# EAGLE design MPU9250 (EAGLE 9.6.2)
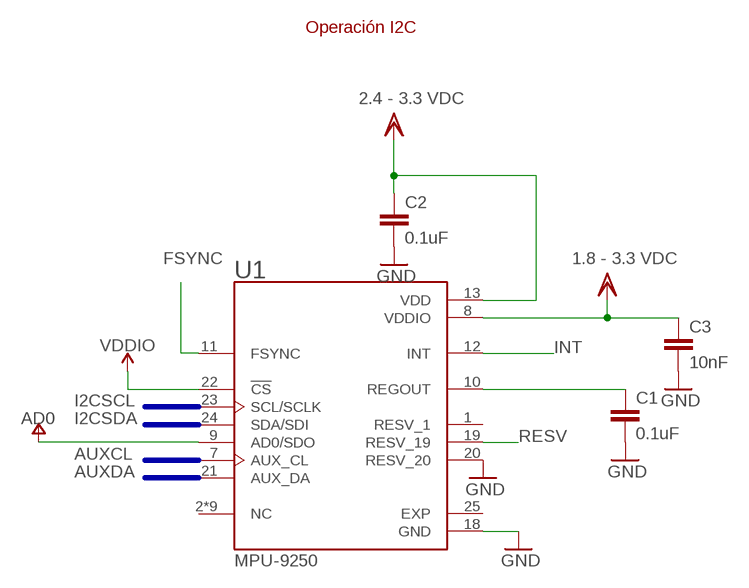
[diagram p0: schematic, sheet 1]

## Parts
C1  0.1uF  CAP-1206  [1206]
C2  0.1uF  CAP-1206  [1206]
C3  10nF  CAP-1206  [1206]
U1  MPU-9250  [QFN40P300X300X105-25N]

## Nets
FSYNC: U1.11(FSYNC)
GND: C1.2 C2.2 C3.2 U1.18(GND) U1.20(RESV_20)
INT: U1.12(INT)
N$1: C1.1 U1.10(REGOUT)
RESV: U1.19(RESV_19)
V+: U1.9(AD0/SDO) ; supply symbol labelled AD0
VDD: C2.1 C3.1 U1.8(VDDIO) U1.13(VDD) ; supply symbol labelled 2.4 - 3.3 VDC, 1.8 - 3.3 VDC
VDDIO: U1.22(!CS)
Unconnected: U1.2(NC) U1.3(NC) U1.4(NC) U1.5(NC) U1.6(NC) U1.7(AUX_CL) U1.14(NC) U1.15(NC) U1.16(NC) U1.17(NC) U1.21(AUX_DA) U1.23(SCL/SCLK) U1.24(SDA/SDI) U1.25(EXP)

## Buses
I2CSCL
I2CSDA
AUXCL
AUXDA

## Notes on the sheet
- Operación I2C

## Power pins joined to a net without a drawn wire
RESV_1: U1.1(RESV_1)

## Library data of the parts
C1-C3 = SparkFun-Capacitors:CAP
U1 = MPU-9250:MPU-9250: Check availability <https://pricing.snapeda.com/parts/MPU-9250/TDK%20InvenSense/view-part?ref=eda>; AVAILABILITY: In Stock; CHECK_PRICES: https://www.snapeda.com/parts/MPU-9250/TDK/view-part/?ref=eda; DESCRIPTION: MPU-9250 series Accelerometer, Gyroscope, Humidity, Magnetometer, Pressure, Temperature Sensor Evaluation Board; MF: TDK InvenSense; MP: MPU-9250; PACKAGE: TFQFN-24 TDK InvenSense; PRICE: None; SNAPEDA_LINK: https://www.snapeda.com/parts/MPU-9250/TDK/view-part/?ref=snap

## Board
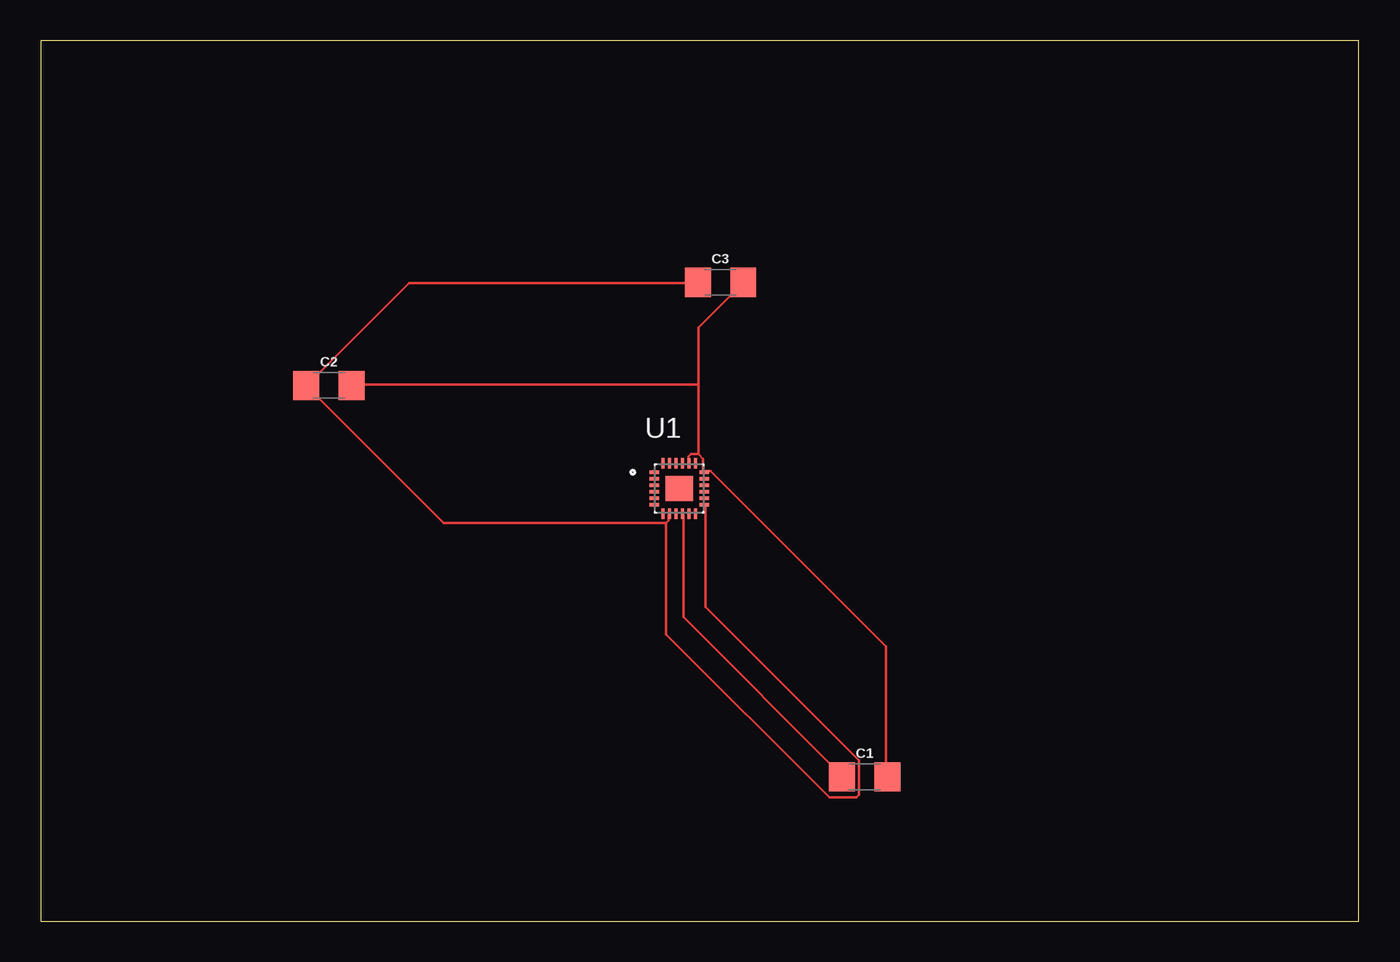
[diagram p1: board, top side]

Size 81.26 x 54.28 mm. Coordinates in mm from the lower left corner, seen from the top.
Outline: 0,0 81.26,0 81.26,54.28 0,54.28 0,0
Copper layers (1*16): Top 0.035mm / dielectric 1.5mm / Bottom 0.035mm
Design rules "default": minimum track width 6mil, minimum drill 0.35mm, track to track 6mil, track to pad 6mil, pad to pad 6mil, via to via 6mil, smd to smd 6mil, copper to edge 40mil, drill to drill 6mil, minimum pad ring 10mil, minimum via ring 8mil, stop-mask expansion 4mil, vias tented up to drill 0mil, thermal gap 10mil

### Footprints (pad centres in the part's own frame; a part is rotated, then mirrored left to right if it is on the bottom)
1206 = smd 1.6 x 1.8: 1 -1.4,0; 2 1.4,0
QFN40P300X300X105-25N = smd 0.64 x 0.22: 1 -1.545,1; 2 -1.545,0.6; 3 -1.545,0.2; 4 -1.545,-0.2; 5 -1.545,-0.6; 6 -1.545,-1; 13 1.545,-1; 14 1.545,-0.6; 15 1.545,-0.2; 16 1.545,0.2; 17 1.545,0.6; 18 1.545,1 | smd 0.22 x 0.64: 7 -1,-1.545; 8 -0.6,-1.545; 9 -0.2,-1.545; 10 0.2,-1.545; 11 0.6,-1.545; 12 1,-1.545; 19 1,1.545; 20 0.6,1.545; 21 0.2,1.545; 22 -0.2,1.545; 23 -0.6,1.545; 24 -1,1.545 | smd 1.7 x 1.54: 25 0,0

### Placement (x,y rotation side)
C1  50.8,8.89 0 top
C2  17.78,33.02 0 top
C3  41.91,39.37 0 top
U1  39.37,26.67 0 top

### Tracks (layer width: path | path; a pad name or v marks a point on that pad's centre or on a via)
GND
  Top 0.152: 40.54,28.8 40.84,28.5 40.84,27.74 U1.18 41,27.74 41.3,27.74 52.12,16.92 52.12,8.99 C1.2 | 40.54,28.8 40.08,28.8 39.93,28.65 39.93,28.35 U1.20 | 40.54,33.07 40.54,36.58 43.28,39.32 C3.2 | 40.54,33.07 40.54,28.8 | 40.54,33.07 19.2,33.07 C2.2
N$1
  Top 0.152: U1.10 39.62,24.99 39.62,18.75 49.38,8.99 C1.1
VDD
  Top 0.152: 38.56,24.54 38.71,24.69 38.71,24.99 U1.8 | 38.56,24.54 24.84,24.54 16.46,32.92 C2.1 16.46,33.07 22.71,39.32 40.39,39.32 C3.1 | 38.56,24.54 38.56,17.68 48.62,7.62 50.29,7.62 50.44,7.77 50.44,9.91 41,19.36 41,25.6 U1.13